# Altium schematic sheet 5V0_EXT_SUPPLY.SchDoc
size A4; SheetNumber: 5; SheetTotal: 12
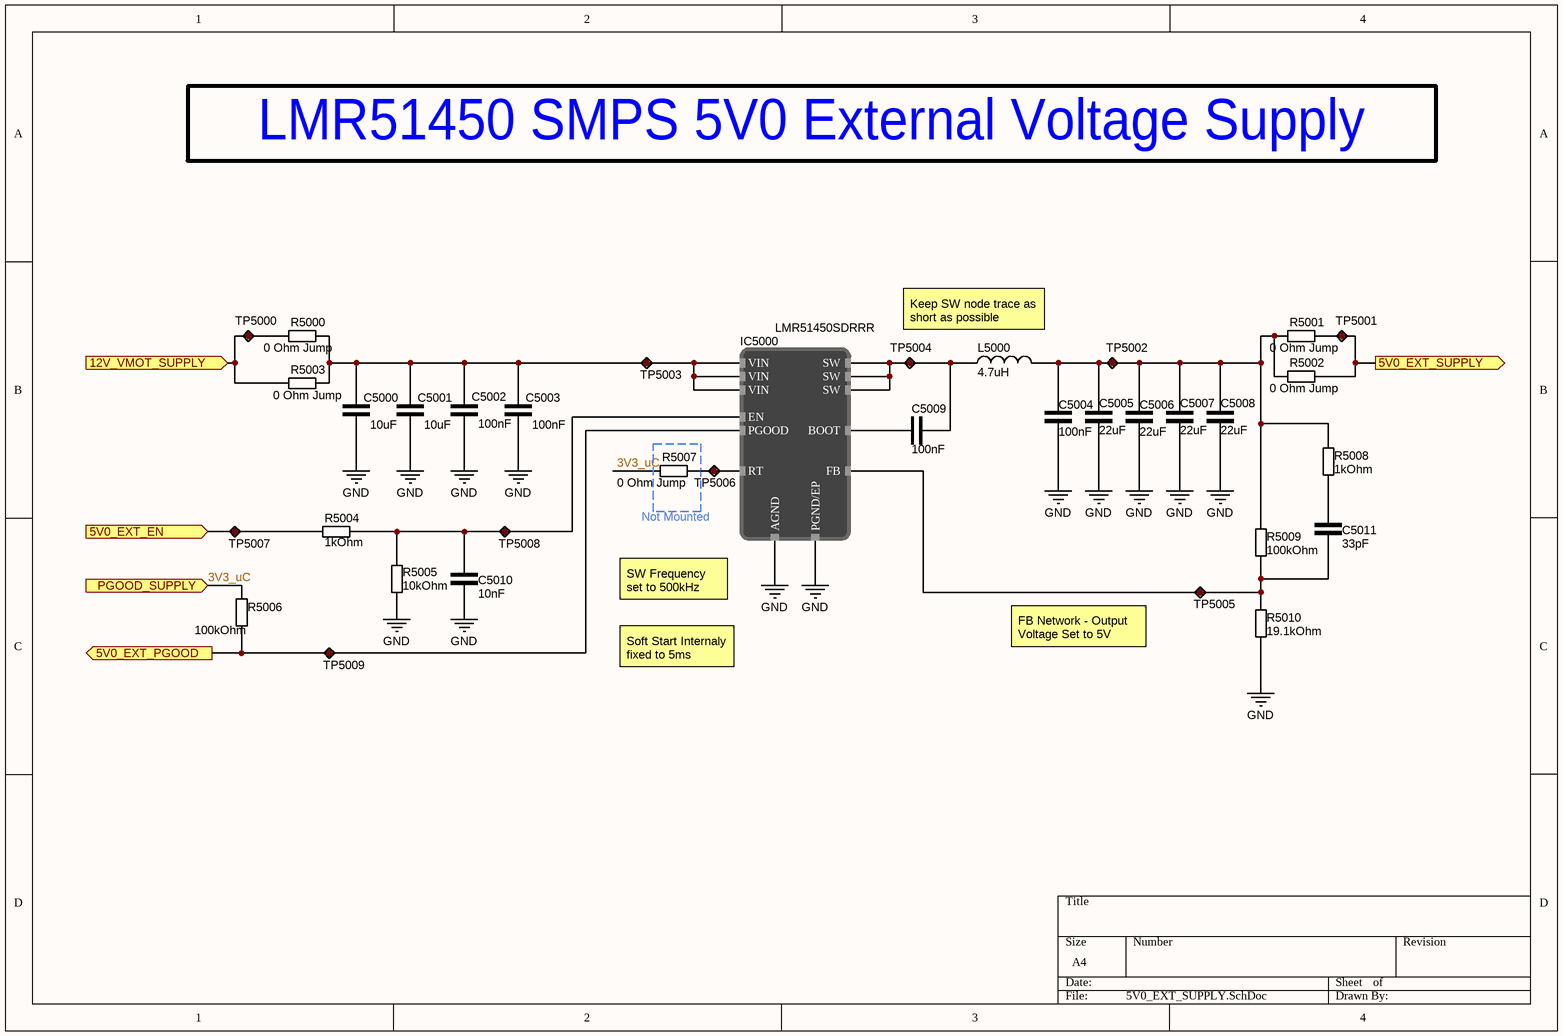
[diagram p0: 5V0_EXT_SUPPLY.SchDoc]

## Parts
C5000  10uF  [CAP_0805]
C5001  10uF  [CAP_0805]
C5002  100nF  [CAP_0603]
C5003  100nF  [CAP_0603]
C5004  100nF  [CAP_0603]
C5005  22uF  [CAP_0805]
C5006  22uF  [CAP_0805]
C5007  22uF  [CAP_0805]
C5008  22uF  [CAP_0805]
C5009  100nF  [CAP_0603]
C5010  10nF  [CAP_0603]
C5011  33pF  [CAP_0603]
IC5000  LMR51450SDRRR  [SON50P300X80_HS-13N]
L5000  4.7uH  [INDP6965X30N]
R5000  0 Ohm Jump  [RES_0805]
R5001  0 Ohm Jump  [RES_1206]
R5002  0 Ohm Jump  [RES_1206]
R5003  0 Ohm Jump  [RES_0805]
R5004  1kOhm  [RES_0603]
R5005  10kOhm  [RES_0603]
R5006  100kOhm  [RES_0603]
R5007  0 Ohm Jump  [RES_0603]
R5008  1kOhm  [RES_0603]
R5009  100kOhm  [RES_0603]
R5010  19.1kOhm  [RES_0603]
TP5000  Test point  [TestPoint]  (value not drawn)
TP5001  Test point  [TestPoint]  (value not drawn)
TP5002  Test point  [TestPoint]  (value not drawn)
TP5003  Test point  [TestPoint]  (value not drawn)
TP5004  Test point  [TestPoint]  (value not drawn)
TP5005  Test point  [TestPoint]  (value not drawn)
TP5006  Test point  [TestPoint]  (value not drawn)
TP5007  Test point  [TestPoint]  (value not drawn)
TP5008  Test point  [TestPoint]  (value not drawn)
TP5009  Test point  [TestPoint]  (value not drawn)

## Ports
5V0_EXT_EN (in, see 6DOF_CONTROLLER_Top[7A]), 5V0_EXT_PGOOD (out, see 6DOF_CONTROLLER_Top[8A]), 5V0_EXT_SUPPLY (out, see 6DOF_CONTROLLER_Top[8A]), 12V_VMOT_SUPPLY (in, see 6DOF_CONTROLLER_Top[7A]), PGOOD_SUPPLY (in, see 6DOF_CONTROLLER_Top[7A], 3V3_SYS_SUPPLY[1C], 12V_VMOT_SUPPLY[6C])

## Nets
GND: C5000.1 C5001.1 C5002.2 C5003.1 C5004.1 C5005.1 C5006.2 C5007.1 C5008.1 C5010.1 IC5000.8(AGND) IC5000.13(PGND/EP) R5005.1 R5010.1
3V3_uC: R5006.2 R5007.1 ; port PGOOD_SUPPLY
5V0_EXT_EN: R5004.1 TP5007.1 ; port 5V0_EXT_EN
5V0_EXT_PGOOD: IC5000.5(PGOOD) R5006.1 TP5009.1 ; port 5V0_EXT_PGOOD
5V0_EXT_SUPPLY: R5001.2 R5002.2 TP5001.1 ; port 5V0_EXT_SUPPLY
12V_VMOT_SUPPLY: R5000.1 R5003.1 TP5000.1 ; port 12V_VMOT_SUPPLY
NetC5000_2: C5000.2 C5001.2 C5002.1 C5003.2 IC5000.10(VIN) IC5000.11(VIN) IC5000.12(VIN) R5000.2 R5003.2 TP5003.1
NetC5004_2: C5004.2 C5005.2 C5006.1 C5007.2 C5008.2 L5000.2 R5001.1 R5002.1 R5008.2 R5009.2 TP5002.1
NetC5009_1: C5009.1 IC5000.4(BOOT)
NetC5009_2: C5009.2 IC5000.1(SW) IC5000.2(SW) IC5000.3(SW) L5000.1 TP5004.1
NetC5010_2: C5010.2 IC5000.9(EN) R5004.2 R5005.2 TP5008.1
NetC5011_1: C5011.1 IC5000.7(FB) R5009.1 R5010.2 TP5005.1
NetC5011_2: C5011.2 R5008.1
NetIC5000_6: IC5000.6(RT) R5007.2 TP5006.1

## Notes on the sheet
- LMR51450 SMPS 5V0 External Voltage Supply
- Keep SW node trace as short as possible
- Not Mounted
- (near IC5000) SW Frequency set to 500kHz
- FB Network - Output Voltage Set to 5V
- Soft Start Internaly fixed to 5ms

## Library data of the parts
C5000 C5001 = C000002: 10 µF ±10% 25V Ceramic Capacitor X5R 0805 (2012 Metric); ComponentLink1Description: DigiKey; ComponentLink1URL: https://www.digikey.com/en/products/detail/tdk-corporation/C2012X5R1E106K125AB/2443462; DigiKey Part Number: 445-5984-1-ND; capacitance: 10uF
C5002-C5004 C5009 = C000007: 0.1 µF ±10% 25V Ceramic Capacitor X7R 0603 (1608 Metric); ComponentLink1Description: DigiKey; ComponentLink1URL: https://www.digikey.com/en/products/detail/kyocera-avx/06033C104K4T2A/8019250; DigiKey Part Number: 478-KAM15AR71E104KTCT-ND; capacitance: 100nF
C5005-C5008 = C000001: 22 µF ±20% 25V Ceramic Capacitor X5R 0805 (2012 Metric); ComponentLink1Description: DigiKey; ComponentLink1URL: https://www.digikey.com/en/products/detail/tdk-corporation/C2012X5R1E226M125AC/3661564; DigiKey Part Number: 445-9112-1-ND; capacitance: 22uF
C5010 = C000005: 10000 pF ±20% 25V Ceramic Capacitor X7R 0603 (1608 Metric); ComponentLink1Description: DigiKey; ComponentLink1URL: https://www.digikey.com/en/products/detail/kyocera-avx/06033C103MAT2A/1599370; DigiKey Part Number: 478-KGM15AR71E103MTCT-ND; capacitance: 10nF
C5011 = C000029: 33 pF ±5% 25V Ceramic Capacitor C0G, NP0 0603 (1608 Metric); ComponentLink1Description: DigiKey; ComponentLink1URL: https://www.digikey.com/en/products/detail/yageo/CC0603JRNPO8BN330/5883595; DigiKey Part Number: 311-3954-1-ND; capacitance: 33pF
IC5000 = LMR51450SDRRR: Buck Switching Regulator IC Positive Adjustable 0.8V 1 Output 5A 12-WFDFN Exposed Pad; DigiKey Part Number: 296-LMR51450SDRRRCT-ND; ComponentLink1Description: DigiKey; ComponentLink1URL: https://www.digikey.com/en/products/detail/texas-instruments/LMR51450SDRRR/17394946; Mouser Part Number: 595-LMR51450SDRRR; ComponentLink2Description: Mouser; ComponentLink2URL: https://eu.mouser.com/ProductDetail/Texas-Instruments/LMR51450SDRRR?qs=rQFj71Wb1eUvKinsjoLiUA%3D%3D
L5000 = L000011: FIXED IND 4.7UH 5.5A 40 MOHM SMD; inductance: 4.7uH; DigiKey Part Number: 541-1010-1-ND; ComponentLink1Description: DigiKey; ComponentLink1URL: https://www.digikey.com/en/products/detail/vishay-dale/IHLP2525CZER4R7M01/1220675
R5000 R5003 = R000011: 0 Ohms Jumper Chip Resistor 0805 (2012 Metric) Automotive AEC-Q200 Thick Film; ComponentLink1Description: DigiKey; ComponentLink1URL: https://www.digikey.com/en/products/detail/panasonic-electronic-components/ERJ-6GEY0R00V/78163; resistance: 0 Ohm Jump; DigiKey Part Number: P0.0ACT-ND
R5001 R5002 = R000012: 0 Ohms Jumper Chip Resistor 1206 (3216 Metric) Automotive AEC-Q200 Thick Film; ComponentLink1Description: DigiKey; ComponentLink1URL: https://www.digikey.com/en/products/detail/stackpole-electronics-inc/RMCF1206ZT0R00/1756906; resistance: 0 Ohm Jump; DigiKey Part Number: RMCF1206ZT0R00CT-ND
R5004 R5008 = R000004: 1 kOhms ±1% 0.125W, 1/8W Chip Resistor 0603 (1608 Metric) Anti-Sulfur Thin Film; resistance: 1kOhm; ComponentLink1Description: DigiKey; ComponentLink1URL: https://www.digikey.com/en/products/detail/vishay-beyschlag-draloric-bc-components/MCT06030C1001FP500/2607821; DigiKey Part Number: MCT0603-1.00K-CFCT-ND
R5005 = R000001: 10 kOhms ±1% 0.125W, 1/8W Chip Resistor 0603 (1608 Metric) Anti-Sulfur Thin Film; resistance: 10kOhm; ComponentLink1Description: DigiKey; ComponentLink1URL: https://www.digikey.com/en/products/detail/vishay-beyschlag-draloric-bc-components/MCT06030C1002FP500/1850440; DigiKey Part Number: MCT0603-10.0K-CFCT-ND
R5006 R5009 = R000006: 100 kOhms ±1% 0.1W, 1/10W Chip Resistor 0603 (1608 Metric) Automotive AEC-Q200 Thick Film; resistance: 100kOhm; ComponentLink1Description: DigiKey; ComponentLink1URL: https://www.digikey.com/en/products/detail/stackpole-electronics-inc/RMCF0603FG100K/1713543; DigiKey Part Number: RMCF0603FG100KCT-ND
R5007 = R000007: 0 Ohms Jumper Chip Resistor 0603 (1608 Metric) Automotive AEC-Q200 Thick Film; ComponentLink1Description: DigiKey; ComponentLink1URL: https://www.digikey.com/en/products/detail/stackpole-electronics-inc/RMCF0603ZT0R00/1756908; resistance: 0 Ohm Jump; DigiKey Part Number: RMCF0603ZT0R00CT-ND
R5010 = R000020: 19.1 kOhms ±1% 0.1W, 1/10W Chip Resistor 0603 (1608 Metric) Moisture Resistant Thick Film; ComponentLink1Description: DigiKey; ComponentLink1URL: https://www.digikey.com/en/products/detail/yageo/RC0603FR-0719K1L/727001; resistance: 19.1kOhm; DigiKey Part Number: 311-19.1KHRCT-ND
TP5000-TP5009 = TP002: Test point 1mm